# Altium schematic sheet FPGA_Supply_Config.SchDoc: FPGA configuration
size A2; Author: M.Beldyga; CompanyName: WUT ISE; DrawnBy: M.Beldyga; Organization: WUT ISE; Address1: PW ISE; Address2: Nowowiejska 15/19 00-665 Warsaw; Address3: micbeldyga@gmail.com; SheetNumber: 9; SheetTotal: 10; ModifiedBy: -; CheckedDate: -; DivGrp: WUT ISE; Designer: M.Beldyga; ModifiedDate: -; ProjectName: Sensor Box
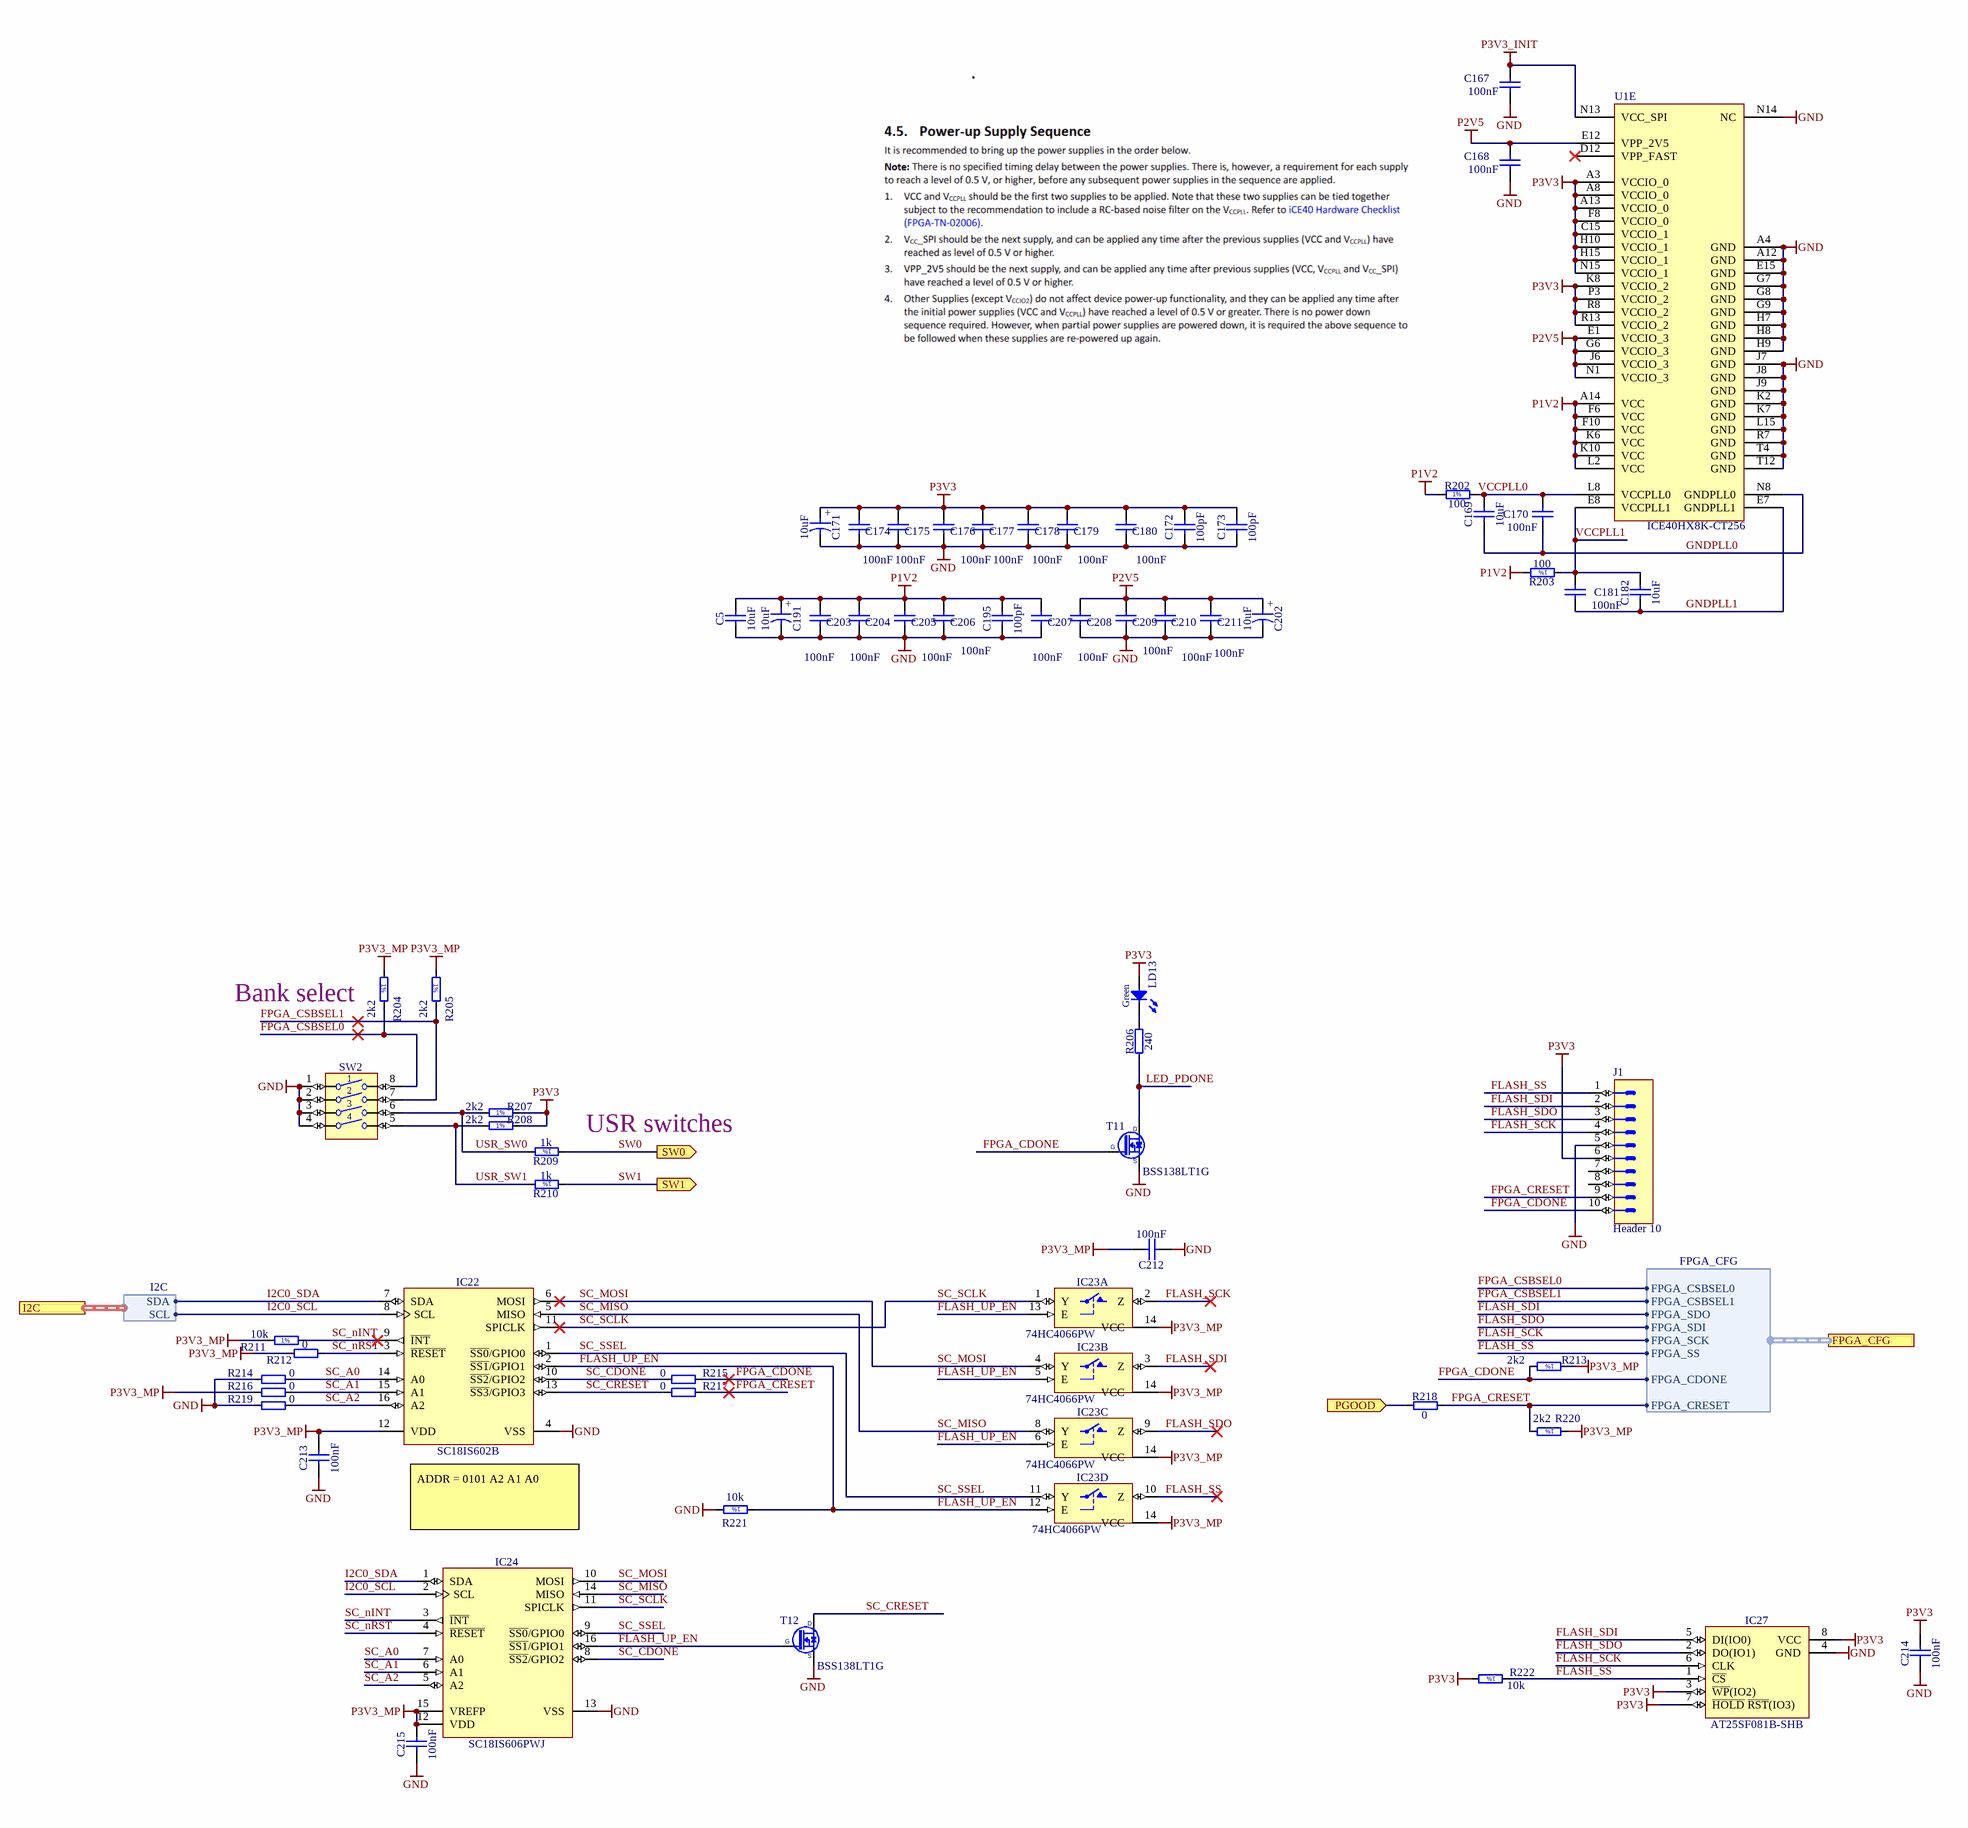
[diagram p0: FPGA_Supply_Config.SchDoc]

## Parts
C5  10uF  [CAPC2012X135N]
C167  100nF  [CAPC1005X55N]
C168  100nF  [CAPC1005X55N]
C169  10uF  [CAPC1005X70N]
C170  100nF  [CAPC1005X55N]
C171  10uF  [CAPMP3216X180N]
C172  100pF  [CAPC1005X55N]
C173  100pF  [CAPC1005X55N]
C174  100nF  [CAPC1005X55N]
C175  100nF  [CAPC1005X55N]
C176  100nF  [CAPC1005X55N]
C177  100nF  [CAPC1005X55N]
C178  100nF  [CAPC1005X55N]
C179  100nF  [CAPC1005X55N]
C180  100nF  [CAPC1005X55N]
C181  100nF  [CAPC1005X55N]
C182  10uF  [CAPC1005X70N]
C191  10uF  [CAPMP3216X180N]
C195  100pF  [CAPC1005X55N]
C202  10uF  [CAPMP3216X180N]
C203  100nF  [CAPC1005X55N]
C204  100nF  [CAPC1005X55N]
C205  100nF  [CAPC1005X55N]
C206  100nF  [CAPC1005X55N]
C207  100nF  [CAPC1005X55N]
C208  100nF  [CAPC1005X55N]
C209  100nF  [CAPC1005X55N]
C210  100nF  [CAPC1005X55N]
C211  100nF  [CAPC1005X55N]
C212  100nF  [CAPC1005X55N]
C213  100nF  [CAPC1005X55N]
C214  100nF  [CAPC1005X55N]
C215  100nF  [CAPC1005X55N]
IC22  SC18IS602B  [SOP65P640X110-16N]
IC23  74HC4066PW  [SOP65P640X110-14N]  (parts A,B,C,D of 4)
IC24  SC18IS606PWJ  [SOP65P640X110-16N]
IC27  AT25SF081B-SHB  [SOIC127P790X216-8N]
J1  Header 10  [HARWIN_M20-9980546]
LD13  Green  [LED_AVAGO_HSME-C120]
R202  100  [RESC1005X40N]
R203  100  [RESC1005X40N]
R204  2k2  [RESC1005X40N]
R205  2k2  [RESC1005X40N]
R206  240  [RESC1005X40N]
R207  2k2  [RESC1005X40N]
R208  2k2  [RESC1005X40N]
R209  1k  [RESC1005X40N]
R210  1k  [RESC1005X40N]
R211  10k  [RESC1005X40N]
R212  0  [RESC1005X40N]
R213  2k2  [RESC1005X40N]
R214  0  [RESC1005X40N]
R215  0  [RESC1005X40N]
R216  0  [RESC1005X40N]
R217  0  [RESC1005X40N]
R218  0  [RESC1005X40N]
R219  0  [RESC1005X40N]
R220  2k2  [RESC1005X40N]
R221  10k  [RESC1005X40N]
R222  10k  [RESC1005X40N]
SW2  Switch  [SW_TYCO_1571983-4]  (value not drawn)
T11  BSS138LT1G  [SOT95P240X110-3N]
T12  BSS138LT1G  [SOT95P240X110-3N]
U1  ICE40HX8K-CT256  [LATC-caBGA-256]  (part E of 5)

## Ports
FPGA_CFG (harness FPGA_CFG), I2C (harness I2C), PGOOD (in), SW0 (out), SW1 (out)

## Harnesses
FPGA_CFG: FPGA_CSBSEL0, FPGA_CSBSEL1, FPGA_SDO, FPGA_SDI, FPGA_SCK, FPGA_SS, FPGA_CDONE, FPGA_CRESET
I2C: SDA, SCL

## Nets
GND: C5.1 C167.1 C168.1 C171.2 C172.1 C173.1 C174.1 C175.1 C176.1 C177.1 C178.1 C179.1 C180.1 C191.2 C195.1 C202.2 C203.1 C204.1 C205.1 C206.1 C207.1 C208.1 C209.1 C210.1 C211.1 C212.1 C213.1 C214.1 C215.1 IC22.4(VSS) IC23.7(GND) IC24.13(VSS) IC27.4(GND) J1.5 R214.2 R219.2 R221.2 SW2.1 SW2.2 SW2.3 SW2.4 T11.2(S) T12.2(S) U1.A4(GND) U1.A12(GND) U1.E15(GND) U1.G7(GND) U1.G8(GND) U1.G9(GND) U1.H7(GND) U1.H8(GND) U1.H9(GND) U1.J7(GND) U1.J8(GND) U1.J9(GND) U1.K2(GND) U1.K7(GND) U1.L15(GND) U1.N14(NC) U1.R7(GND) U1.T4(GND) U1.T12(GND)
P1V2: C5.2 C191.1 C195.2 C203.2 C204.2 C205.2 C206.2 C207.2 R202.1 R203.2 U1.A14(VCC) U1.F6(VCC) U1.F10(VCC) U1.K6(VCC) U1.K10(VCC) U1.L2(VCC)
P2V5: C168.2 C202.1 C208.2 C209.2 C210.2 C211.2 U1.E1(VCCIO_3) U1.E12(VPP_2V5) U1.G6(VCCIO_3) U1.J6(VCCIO_3) U1.N1(VCCIO_3)
P3V3: C171.1 C172.2 C173.2 C174.2 C175.2 C176.2 C177.2 C178.2 C179.2 C180.2 C214.2 IC27.3(~{WP}(IO2)) IC27.7(~{HOLD}_~{RST}(IO3)) IC27.8(VCC) J1.6 LD13.2(A) R207.2 R208.2 R222.2 U1.A3(VCCIO_0) U1.A8(VCCIO_0) U1.A13(VCCIO_0) U1.C15(VCCIO_1) U1.F8(VCCIO_0) U1.H10(VCCIO_1) U1.H15(VCCIO_1) U1.K8(VCCIO_2) U1.N15(VCCIO_1) U1.P3(VCCIO_2) U1.R8(VCCIO_2) U1.R13(VCCIO_2)
P3V3_INIT: C167.2 U1.N13(VCC_SPI)
P3V3_MP: C212.2 C213.2 C215.2 IC22.12(VDD) IC23.14(VCC) IC24.12(VDD) IC24.15(VREFP) R204.1 R205.1 R211.1 R212.2 R213.1 R216.2 R220.1
FLASH_SCK: IC23.2(Z) IC27.6(CLK) J1.4 ; port FPGA_CFG.FPGA_SCK
FLASH_SDI: IC23.3(Z) IC27.5(DI(IO0)) J1.2 ; port FPGA_CFG.FPGA_SDO
FLASH_SDO: IC23.9(Z) IC27.2(DO(IO1)) J1.3 ; port FPGA_CFG.FPGA_SDI
FLASH_SS: IC23.10(Z) IC27.1(~{CS}) J1.1 R222.1 ; port FPGA_CFG.FPGA_SS
FLASH_UP_EN: IC22.2(~{SS1}/GPIO1) IC23.5(E) IC23.6(E) IC23.12(E) IC23.13(E) IC24.16(~{SS1}/GPIO1) R221.1 T12.1(G)
FPGA_CDONE: J1.10 R213.2 R215.1 T11.1(G) ; port FPGA_CFG.FPGA_CDONE
FPGA_CRESET: J1.9 R217.1 R218.2 R220.2 ; port FPGA_CFG.FPGA_CRESET
FPGA_CSBSEL0: R204.2 SW2.8 ; port FPGA_CFG.FPGA_CSBSEL0
FPGA_CSBSEL1: R205.2 SW2.7 ; port FPGA_CFG.FPGA_CSBSEL1
GNDPLL0: C169.1 C170.1 U1.N8(GNDPLL0)
GNDPLL1: C181.1 C182.1 U1.E7(GNDPLL1)
I2C0_SCL: IC22.8(SCL) IC24.2(SCL) ; port I2C.SCL
I2C0_SDA: IC22.7(SDA) IC24.1(SDA) ; port I2C.SDA
LED_PDONE: R206.1 T11.3(D)
PGOOD: R218.1 ; port PGOOD
SC_A0: IC22.14(A0) IC24.7(A0) R214.1
SC_A1: IC22.15(A1) IC24.6(A1) R216.1
SC_A2: IC22.16(A2) IC24.5(A2) R219.1
SC_CDONE: IC22.10(~{SS2}/GPIO2) IC24.8(~{SS2}/GPIO2) R215.2
SC_CRESET: IC22.13(~{SS3}/GPIO3) R217.2 T12.3(D)
SC_MISO: IC22.5(MISO) IC23.8(Y) IC24.14(MISO)
SC_MOSI: IC22.6(MOSI) IC23.4(Y) IC24.10(MOSI)
SC_nINT: IC22.9(~{INT}) IC24.3(~{INT}) R211.2
SC_nRST: IC22.3(~{RESET}) IC24.4(~{RESET}) R212.1
SC_SCLK: IC22.11(SPICLK) IC23.1(Y) IC24.11(SPICLK)
SC_SSEL: IC22.1(~{SS0}/GPIO0) IC23.11(Y) IC24.9(~{SS0}/GPIO0)
SW0: R209.1 ; port SW0
SW1: R210.1 ; port SW1
USR_SW0: R207.1 R209.2 SW2.6
USR_SW1: R208.1 R210.2 SW2.5
VCCPLL0: C169.2 C170.2 R202.2 U1.L8(VCCPLL0)
VCCPLL1: C181.2 C182.2 R203.1 U1.E8(VCCPLL1)
NetLD13_1: LD13.1(C) R206.2

Not connected (* = marked no-connect by the designer): J1 7 8; U1 D12(VPP_FAST)*

## Notes on the sheet
- (near R204) Bank select
- (near R209) USR switches
- ADDR = 0101 A2 A1 A0
- Project/Equipment
- Document
- Designer
- Drawn by
- Check.by
- Last Mod.
- Contact
- File
- Print Date
- Sheet
- Size
- A2
- of
- Rev
- (in symbol CTE3216-18_10UF_16V_20%_AVX_TCJ) +
- (in symbol R0402_1K_1%_0.0625W_100PPM) 1%
- (in symbol R0402_2K2_1%_0.0625W_100PPM) 1%
- (in symbol R0402_10K_1%_0.0625W_100PPM) 1%
- (in symbol R0402_100R_1%_0.0625W_100PPM) 1%

## Library data of the parts
C5 = CC0805_10UF_16V_10%_X5R: Non-polarised capacitor; Part Description: SMD Multilayer Chip Ceramic Capacitor; Manufacturer: GENERIC; Manufacturer1 Part Number: C0805C106K4PAC; Voltage: 16V; TC: X5R; Tolerance: ±10%; Part Number: CC0805_10UF_16V_10%_X5R; Component Kind: Standard; Component Type: Standard; Pin Count: 2; Value: 10uF; Status: Preferred; Manufacturer Part Number: CC0805_10UF_16V_10%_X5R; Case: 0805; Mounted: Yes; Socket: No; SMD: Yes; Manufacturer1 Example: KEMET; Manufacturer1 ComponentHeight: 1.4mm; HelpURL: \\cern.ch\dfs\Applications\Altium\Datasheets\CC1206_X5R_KEMET.pdf; Author: CERN DEM JLC; CreateDate: 03.12.2007; LatestRevisionDate: 03.12.2007; Sense: No
C167 C168 C170 C174-C181 C203-C211 = CC0402_100NF_16V_10%_X5R: Non-polarised capacitor; Part Description: SMD Multilayer Chip Ceramic Capacitor; Manufacturer: GENERIC; Manufacturer1 Part Number: GRM155R61C104KA88D; Voltage: 16V; TC: X5R; Tolerance: ±10%; Table: Capacitors SMD; Part Number: CC0402_100NF_16V_10%_X5R; Component Kind: Standard; Component Type: Standard; Pin Count: 2; Value: 100nF; Status: None; Manufacturer Part Number: CC0402_100NF_16V_10%_X5R; Case: 0402; Mounted: Yes; Socket: No; SMD: Yes; Manufacturer1 Example: MURATA; Manufacturer1 ComponentHeight: 0.55mm; HelpURL: \\cern.ch\dfs\Applications\Altium\Datasheets\CC0402_X5R_MURATA_GRM.pdf; Author: CERN DEM JLC; CreateDate: 2013-12-10; LatestRevisionDate: 2013-12-10
C169 C182 = CC0402_10UF_6.3V_20%_X5R: Non-polarised capacitor; Part Description: SMD Multilayer Chip Ceramic Capacitor; Manufacturer: GENERIC; Manufacturer1 Part Number: C1005X5R0J106M050BC; Voltage: 6.3V; TC: X5R; Tolerance: ±10%; Part Number: CC0402_10UF_6.3V_20%_X5R; Component Kind: Standard; Component Type: Standard; Pin Count: 2; Value: 10uF; Status: Preferred; Manufacturer Part Number: CC0402_10UF_6.3V_20%_X5R; Case: 0402; Mounted: Yes; Socket: No; SMD: Yes; Manufacturer1 Example: TDK; Manufacturer1 ComponentHeight: 0.70mm; HelpURL: \\cern.ch\dfs\Applications\Altium\Datasheets\CC0402_X5R_TDK_C.pdf; Author: CERN DEM JLC; CreateDate: 07.01.2015; LatestRevisionDate: 07.01.2015; Sense: No
C171 C191 C202 = CTE3216-18_10UF_16V_20%_AVX_TCJ: Polarised capacitor; Part Description: ESR 0R200 Tantalum Solid Electrolytic Chip Capacitor with Conductive Polymer Electrode; Manufacturer: AVX; Manufacturer Part Number: TCJA106M016R0200 or  or TR3A106K016C1700; Voltage: 16V; Tolerance: ±20%; Part Number: CTE3216-18_10UF_16V_20%_AVX_TCJ; Component Kind: Standard; Component Type: Standard; Pin Count: 2; Value: 10uF; Status: Preferred; Case: A; Mounted: Yes; Socket: No; SMD: Yes; Sense: No; ComponentHeight: 1.8mm; HelpURL: \\cern.ch\dfs\Applications\Altium\Datasheets\CTE_AVX_TCJ.pdf; Author: CERN DEM JLC; CreateDate: 29.03.2012; LatestRevisionDate: 29.03.2012
C172 C173 C195 = CC0402_100PF_50V_5%_C0G: Non-polarised capacitor; Part Description: SMD Multilayer Chip Ceramic Capacitor; Manufacturer: GENERIC; Manufacturer1 Part Number: C0402C101J5GACTU; Voltage: 50V; TC: C0G/NP0; Tolerance: ±5%; Part Number: CC0402_100PF_50V_5%_C0G; Component Kind: Standard; Component Type: Standard; Pin Count: 2; Value: 100pF; Status: Preferred; Manufacturer Part Number: CC0402_100PF_50V_5%_C0G; Case: 0402; Mounted: Yes; Socket: No; SMD: Yes; Manufacturer1 Example: KEMET; Manufacturer1 ComponentHeight: 0.55mm; HelpURL: \\cern.ch\dfs\Applications\Altium\Datasheets\CC0402_C0G_KEMET_(Commercial Grade).pdf; Author: CERN DEM JLC; CreateDate: 03.12.2007; LatestRevisionDate: 22.04.2015; Sense: No
C212-C215 = CC0402_100NF_16V_10%_X5R: Non-polarised capacitor; Part Description: SMD Multilayer Chip Ceramic Capacitor; Manufacturer: GENERIC; Manufacturer1 Part Number: GRM155R61C104KA88D; Voltage: 16V; TC: X5R; Tolerance: ±10%; Part Number: CC0402_100NF_16V_10%_X5R; Component Kind: Standard; Component Type: Standard; Pin Count: 2; Value: 100nF; Status: None; Manufacturer Part Number: CC0402_100NF_16V_10%_X5R; Case: 0402; Mounted: Yes; Socket: No; SMD: Yes; Sense: No; Manufacturer1 Example: MURATA; Manufacturer1 ComponentHeight: 0.55mm; HelpURL: \\cern.ch\dfs\Applications\Altium\Datasheets\CC0402_X5R_MURATA_GRM.pdf; Author: CERN DEM JLC; CreateDate: 10.12.2013; LatestRevisionDate: 10.12.2013
IC22 = SC18IS602B: I2C-bus to SPI bridge; Manufacturer: NXP SEMICONDUCTORS; PressFit: No; Bonding: No; Part Number: SC18IS602B; Component Kind: Standard; Component Type: Standard; Device: SC18IS602B; PackageDescription: SOP, 0.65mm pitch; 16 pin, 4.40mm W X 5.00mm L X 1.10mm H body IPC Medium Density; Part Description: I2C-Bus to SPI Bridge; Manufacturer Part Number: SC18IS602B; Pin Count: 16; Case: TSSOP16; Mounted: Yes; Socket: No; SMD: Yes; Sense: No; ComponentHeight: 1.1mm; HelpURL: \\cern.ch\dfs\Applications\Altium\Datasheets\SC18IS602B.pdf; Author: CERN DEM MR; CreateDate: 14/12/2015; LatestRevisionDate: 14/12/2015
IC23 = 74HC4066PW: Part Description: Quad Single-Pole Single-Throw Analog Switch; Manufacturer: NXP SEMICONDUCTORS; PressFit: No; Bonding: No; Table: Standard Logic; Part Number: 74HC4066PW; Component Kind: Standard; Component Type: Standard; Device: 74HC4066PW; PackageDescription: SOP, 14-Leads, Body 4.4x5mm (max), Pitch 0.65mm, IPC Medium Density; Manufacturer Part Number: 74HC4066PW; Pin Count: 14; Case: TSSOP14; Mounted: Yes; Socket: No; SMD: Yes; ComponentHeight: 1.1mm; Author: CERN DEM JLC; HelpURL: \\cern.ch\dfs\Applications\Altium\Datasheets\74HC4066PW.pdf; CreateDate: 2014-11-19; LatestRevisionDate: 2014-11-19
IC24 = SC18IS606PWJ: I2C-bus to SPI bridge; Manufacturer: NXP SEMICONDUCTORS; PressFit: No; Bonding: No; Part Number: SC18IS606PWJ; Component Kind: Standard; Component Type: Standard; Device: SC18IS606PWJ; PackageDescription: SOP, 0.65mm pitch; 16 pin, 4.40mm W X 5.00mm L X 1.10mm H body IPC Medium Density; Part Description: I2C-Bus to SPI Bridge; Manufacturer Part Number: SC18IS606PWJ; Pin Count: 16; Case: TSSOP16; Mounted: Yes; Socket: No; SMD: Yes; Sense: No; ComponentHeight: 1.1mm; HelpURL: \\cern.ch\dfs\Applications\Altium\Datasheets\SC18IS602B.pdf; Author: GK; CreateDate: 14/12/2015; LatestRevisionDate: 14/12/2015
IC27 = MEM_AT25SF081B-SHB: 8M-bit Serial Flash Memory with uniform 4KB sectors and Dual/Quad SPI and QPI; Manufacturer: Renesas; PressFit: No; Bonding: No; Part Number: AT25SF081B-SHB; Component Kind: Standard; Component Type: Standard; Device: AT25SF081B-SHB; PackageDescription: SOIC, 1.27mm Pitch; 8 Pin, 5.285mm W X 5.335mm L X 2.16mm H body, IPC Medium Density; Part Description: 8M-bit Serial Flash Memory with uniform 4KB sectors and Dual/Quad SPI and QPI; Manufacturer Part Number: AT25SF081B-SHB; Pin Count: 8; Case: SOIC8; Mounted: Yes; Socket: No; SMD: Yes; Sense: No; ComponentHeight: 2.16mm; HelpURL: \\cern.ch\dfs\Applications\Altium\Datasheets\W25Q128FVSIG.pdf; Author: GK; CreateDate: 26/01/2018; LatestRevisionDate: 26/01/2018
J1 = HARWIN_M20-9980546: Connector 10 Male; Part Description: 10 Contacts - Pitch 2.54mm - Dual Row Straight Header (Lead Length 6.1mm, Insulator 2.54mm); Manufacturer: HARWIN; PressFit: No; Part Number: HARWIN_M20-9980546; Component Kind: Standard; Component Type: Standard; Pin Count: 10; Family: Header 10; Mounted: Yes; Socket: No; SMD: No; Sense: No; Status: None; Manufacturer Part Number: M20-9980546; ComponentHeight: 8.64mm; HelpURL: \\cern.ch\dfs\Applications\Altium\Datasheets\HARWIN_M20-9980546.pdf; Author: CERN DEM MR; CreateDate: 9/15/2017; LatestRevisionDate: 9/15/2017
LD13 = LED_AVAGO_HSME-C120: LED Green 1C 2A; Part Description: High Performance Right Angle Chip Green LED; Manufacturer: AVAGO TECHNOLOGIES; PressFit: No; Bonding: No; Part Number: LED_AVAGO_HSME-C120; Component Kind: Standard; Component Type: Standard; Color: Green; PackageDescription: Green Chip LED, 2-Leads, Body 1.7x1.1mm, Side Emitting Package; Manufacturer Part Number: HSME-C120; Pin Count: 2; Mounted: Yes; Socket: No; SMD: Yes; Sense: No; ComponentHeight: 0.7mm; HelpURL: \\cern.ch\dfs\Applications\Altium\Datasheets\LED_AVAGO_HSME-C120.pdf; ComponentLink1URL: \\cern.ch\dfs\Applications\Altium\Datasheets\LED_AVAGO_HSME-C110_DESIGN-GUIDE.pdf; ComponentLink1Description: Design Guide; Author: CERN DEM JMW; CreateDate: 22.07.2009; LatestRevisionDate: 20.06.2012
R202 R203 = R0402_100R_1%_0.0625W_100PPM: Resistor - 1%; Part Description: General Purpose Thick Film Chip Resistor; Manufacturer: GENERIC; Manufacturer1 Part Number: 232270671001L; TC: ±100ppm/°C; Table: Resistors SMD; Part Number: R0402_100R_1%_0.0625W_100PPM; Component Kind: Standard; Component Type: Standard; Pin Count: 2; Value: 100; Status: Not recommended; Power: 0.0625W; Tolerance: ±1%; Manufacturer Part Number: R0402_100R_1%_0.0625W_100PPM; Case: 0402; Mounted: Yes; Socket: No; SMD: Yes; Manufacturer1 Example: YAGEO PHYCOMP; Manufacturer1 ComponentHeight: 0.4mm; HelpURL: \\cern.ch\dfs\Applications\Altium\Datasheets\R0402_Phycomp_RC0402.pdf; Author: CERN DEM JLC; CreateDate: 2007-12-03; LatestRevisionDate: 2012-10-17
R204 R205 R207 R208 R213 R220 = R0402_2K2_1%_0.0625W_100PPM: Resistor - 1%; Part Description: General Purpose Thick Film Chip Resistor; Manufacturer: GENERIC; Manufacturer1 Part Number: 232270672202L; TC: ±100ppm/°C; Table: Resistors SMD; Part Number: R0402_2K2_1%_0.0625W_100PPM; Component Kind: Standard; Component Type: Standard; Pin Count: 2; Value: 2k2; Status: Not recommended; Power: 0.0625W; Tolerance: ±1%; Manufacturer Part Number: R0402_2K2_1%_0.0625W_100PPM; Case: 0402; Mounted: Yes; Socket: No; SMD: Yes; Manufacturer1 Example: YAGEO PHYCOMP; Manufacturer1 ComponentHeight: 0.4mm; HelpURL: \\cern.ch\dfs\Applications\Altium\Datasheets\R0402_Phycomp_RC0402.pdf; Author: CERN DEM JLC; CreateDate: 2007-12-03; LatestRevisionDate: 2012-10-17
R206 = R0402_240R_1%_0.0625W_100PPM: Resistor - 1%; Part Description: General Purpose Thick Film Chip Resistor; Manufacturer: GENERIC; Manufacturer1 Part Number: 232270672401L; TC: ±100ppm/°C; PressFit: No; Part Number: R0402_240R_1%_0.0625W_100PPM; Component Kind: Standard; Component Type: Standard; Pin Count: 2; Value: 240; Status: Not Recommended; Power: 0.0625W; Tolerance: ±1%; Manufacturer Part Number: R0402_240R_1%_0.0625W_100PPM; Case: 0402; Mounted: Yes; Sense: No; Socket: No; SMD: Yes; Manufacturer1 Example: YAGEO PHYCOMP; Manufacturer1 ComponentHeight: 0.4mm; HelpURL: \\cern.ch\dfs\Applications\Altium\Datasheets\R0402_Phycomp_RC0402.pdf; Author: CERN DEM JLC; CreateDate: 03.12.2007; LatestRevisionDate: 17.10.2012
R209 R210 = R0402_1K_1%_0.0625W_100PPM: Resistor - 1%; Part Description: General Purpose Thick Film Chip Resistor; Manufacturer: GENERIC; Manufacturer1 Part Number: 232270671002L; TC: ±100ppm/°C; PressFit: No; Part Number: R0402_1K_1%_0.0625W_100PPM; Component Kind: Standard; Component Type: Standard; Pin Count: 2; Value: 1k; Status: Not Recommended; Power: 0.0625W; Tolerance: ±1%; Manufacturer Part Number: R0402_1K_1%_0.0625W_100PPM; Case: 0402; Mounted: Yes; Socket: No; SMD: Yes; Manufacturer1 Example: YAGEO PHYCOMP; Manufacturer1 ComponentHeight: 0.4mm; HelpURL: \\cern.ch\dfs\Applications\Altium\Datasheets\R0402_Phycomp_RC0402.pdf; Author: CERN DEM JLC; CreateDate: 03.12.2007; LatestRevisionDate: 17.10.2012; Sense: No
R211 R221 R222 = R0402_10K_1%_0.0625W_100PPM: Resistor - 1%; Part Description: General Purpose Thick Film Chip Resistor; Manufacturer: GENERIC; Manufacturer1 Part Number: 232270671003L; TC: ±100ppm/°C; Table: Resistors SMD; Part Number: R0402_10K_1%_0.0625W_100PPM; Component Kind: Standard; Component Type: Standard; Pin Count: 2; Value: 10k; Status: Not recommended; Power: 0.0625W; Tolerance: ±1%; Manufacturer Part Number: R0402_10K_1%_0.0625W_100PPM; Case: 0402; Mounted: Yes; Socket: No; SMD: Yes; Manufacturer1 Example: YAGEO PHYCOMP; Manufacturer1 ComponentHeight: 0.4mm; HelpURL: \\cern.ch\dfs\Applications\Altium\Datasheets\R0402_Phycomp_RC0402.pdf; Author: CERN DEM JLC; CreateDate: 2007-12-03; LatestRevisionDate: 2012-10-17
R212 R214-R219 = R0402_0R_JUMPER: Resistor; Part Description: 1A (0.05R Max DC Resistance) Zero Ohm Jumper; Manufacturer: GENERIC; Manufacturer1 Part Number: 232270591001L; PressFit: No; Part Number: R0402_0R_JUMPER; Component Kind: Standard; Component Type: Standard; Pin Count: 2; Value: 0; Status: Not Recommended; Manufacturer Part Number: R0402_0R_JUMPER; Case: 0402; Mounted: Yes; Socket: No; SMD: Yes; Manufacturer1 Example: YAGEO PHYCOMP; Manufacturer1 ComponentHeight: 0.4mm; HelpURL: \\cern.ch\dfs\Applications\Altium\Datasheets\R0402_Phycomp_RC0402.pdf; Author: CERN DEM JLC; CreateDate: 03.12.2007; LatestRevisionDate: 17.10.2012; Sense: No
SW2 = SW_TYCO_1571983-4: 4 Ways SPST DIP Switch; Part Description: 4 Way SPST SMD DIP Switch, Latched, Contact Rating 0.025A 24VDC; Manufacturer: TYCO; Manufacturer Part Number: 1571983-4 or GDH04S04; PressFit: No; Part Number: SW_TYCO_1571983-4; Component Kind: Standard; Component Type: Standard; Pin Count: 8; PackageDescription: Pitch 1.27mm,  Body 6.2x6.2mm, 4 Ways SPST Surface-Mount DIP Switch, TYCO GDH Series; Family: Switch; Mounted: Yes; Socket: No; SMD: Yes; Sense: No; Status: None; ComponentHeight: 2.31mm; HelpURL: \\cern.ch\dfs\Applications\Altium\Datasheets\SW_TYCO_1571983-4.pdf; Author: CERN DEM JLC; CreateDate: 08/01/2009; LatestRevisionDate: 08/01/2009
T11 T12 = BSS138LT1G: N-CHANNEL MOSFET WITH DIODE; Part Description: 50V 200mA N-Channel Enhancement Mode Field-Effect Transistor; Manufacturer: ON SEMICONDUCTOR; PressFit: No; Bonding: No; Part Number: BSS138LT1G; Component Kind: Standard; Component Type: Standard; Device: BSS138LT1G; PackageDescription: SOT23 3-Leads, Pitch 0.95mm - Body 1.4x3mm, IPC Medium Density; Manufacturer Part Number: BSS138LT1G; Pin Count: 3; Case: SOT23-3; Mounted: Yes; Socket: No; SMD: Yes; Sense: No; ComponentHeight: 1.11mm; HelpURL: \\cern.ch\dfs\Applications\Altium\Datasheets\BSS138LT1G.pdf; Author: CERN DEM JLC; CreateDate: 23.03.2009; LatestRevisionDate: 23.03.2009
U1 = CMP-0962-00001-1: iCE40 HX8K Series FPGA Family, 7680 Logic Cells, 1.2 V Core, 128 K Embedded RAM Bits, 256-ball caBGA, Pb-Free, Tray; Manufacturer: Lattice Semiconductor; Supply Voltage: 1.2V; Phase-Locked Loops: 2; Logic Cells: 7680; Embedded RAM Bits: 128K; PackageReference: caBGA-256; PackageDescription: 256-Ball Chip Array Ball Grid Array, Body 14 x 14 mm, Pitch 0.8 mm; RoHS: TRUE; Packing: Tray; Mounting Technology: Surface Mount; ComponentLink3URL: http://www.latticesemi.com/lit/docs/package/pkg.pdf; ComponentLink1Description: Manufacturer URL; ComponentLink3Description: Package Specification; Code_JEDEC: MO-275; PackageVersion: Rev. 03.9, 02/2013; ComponentLink1URL: http://www.latticesemi.com/en; ComponentLink2URL: http://www.latticesemi.com/~/media/Documents/DataSheets/iCE/iCE40LPHXFamilyDataSheet.pdf; Manufacturer Part Number: ICE40HX8K-CT256; ComponentLink2Description: Datasheet; DatasheetVersion: Rev. 02.9